# Altium schematic sheet BDAN.SchDoc
size A4; SheetNumber: 1; SheetTotal: 5
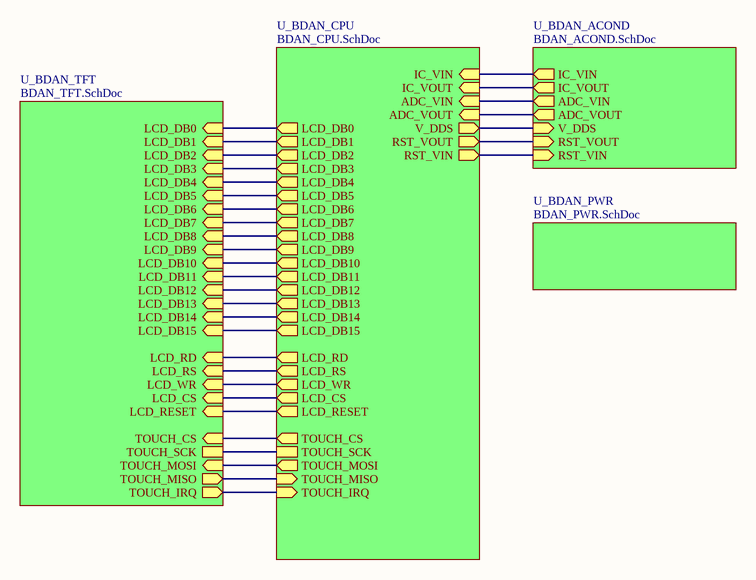
[diagram p0: BDAN.SchDoc]

## Sub-sheets
U_BDAN_ACOND = BDAN_ACOND.SchDoc: IC_VIN (out), IC_VOUT (out), ADC_VIN (out), ADC_VOUT (out), V_DDS (in), RST_VOUT (in), RST_VIN (in)
U_BDAN_CPU = BDAN_CPU.SchDoc: V_DDS (out), LCD_WR (out), LCD_RD (out), LCD_DB8 (out), LCD_DB9 (out), LCD_DB10 (out), LCD_DB11 (out), LCD_DB12 (out), LCD_DB13 (out), LCD_DB14 (out), LCD_DB15 (out), LCD_DB2 (out), LCD_DB3 (out), LCD_DB4 (out), LCD_DB5 (out), LCD_DB6 (out), LCD_DB7 (out), TOUCH_SCK, TOUCH_CS (out), TOUCH_MOSI (out), TOUCH_MISO (in), LCD_DB1 (out), LCD_DB0 (out), LCD_RS (out), LCD_RESET (out), ADC_VIN (in), ADC_VOUT (in), TOUCH_IRQ (in), RST_VOUT (out), IC_VIN (in), LCD_CS (out), IC_VOUT (in), RST_VIN (out)
U_BDAN_PWR = BDAN_PWR.SchDoc: no entries
U_BDAN_TFT = BDAN_TFT.SchDoc: LCD_RS (in), LCD_WR (in), LCD_RD (in), LCD_DB8 (in), LCD_DB9 (in), LCD_DB10 (in), LCD_DB11 (in), LCD_DB12 (in), LCD_DB13 (in), LCD_DB14 (in), LCD_DB15 (in), LCD_CS (in), LCD_RESET (in), LCD_DB2 (in), LCD_DB3 (in), LCD_DB4 (in), LCD_DB5 (in), LCD_DB6 (in), LCD_DB7 (in), TOUCH_SCK, TOUCH_CS (in), TOUCH_MOSI (in), TOUCH_MISO (out), TOUCH_IRQ (out), LCD_DB1 (in), LCD_DB0 (in)

## Nets
(unnamed): sheet U_BDAN_ACOND/IC_VIN, sheet U_BDAN_CPU/IC_VIN
(unnamed): sheet U_BDAN_ACOND/IC_VOUT, sheet U_BDAN_CPU/IC_VOUT
(unnamed): sheet U_BDAN_ACOND/ADC_VIN, sheet U_BDAN_CPU/ADC_VIN
(unnamed): sheet U_BDAN_ACOND/ADC_VOUT, sheet U_BDAN_CPU/ADC_VOUT
(unnamed): sheet U_BDAN_ACOND/V_DDS, sheet U_BDAN_CPU/V_DDS
(unnamed): sheet U_BDAN_ACOND/RST_VOUT, sheet U_BDAN_CPU/RST_VOUT
(unnamed): sheet U_BDAN_ACOND/RST_VIN, sheet U_BDAN_CPU/RST_VIN
(unnamed): sheet U_BDAN_CPU/LCD_WR, sheet U_BDAN_TFT/LCD_WR
(unnamed): sheet U_BDAN_CPU/LCD_RD, sheet U_BDAN_TFT/LCD_RD
(unnamed): sheet U_BDAN_CPU/LCD_DB8, sheet U_BDAN_TFT/LCD_DB8
(unnamed): sheet U_BDAN_CPU/LCD_DB9, sheet U_BDAN_TFT/LCD_DB9
(unnamed): sheet U_BDAN_CPU/LCD_DB10, sheet U_BDAN_TFT/LCD_DB10
(unnamed): sheet U_BDAN_CPU/LCD_DB11, sheet U_BDAN_TFT/LCD_DB11
(unnamed): sheet U_BDAN_CPU/LCD_DB12, sheet U_BDAN_TFT/LCD_DB12
(unnamed): sheet U_BDAN_CPU/LCD_DB13, sheet U_BDAN_TFT/LCD_DB13
(unnamed): sheet U_BDAN_CPU/LCD_DB14, sheet U_BDAN_TFT/LCD_DB14
(unnamed): sheet U_BDAN_CPU/LCD_DB15, sheet U_BDAN_TFT/LCD_DB15
(unnamed): sheet U_BDAN_CPU/LCD_DB2, sheet U_BDAN_TFT/LCD_DB2
(unnamed): sheet U_BDAN_CPU/LCD_DB3, sheet U_BDAN_TFT/LCD_DB3
(unnamed): sheet U_BDAN_CPU/LCD_DB4, sheet U_BDAN_TFT/LCD_DB4
(unnamed): sheet U_BDAN_CPU/LCD_DB5, sheet U_BDAN_TFT/LCD_DB5
(unnamed): sheet U_BDAN_CPU/LCD_DB6, sheet U_BDAN_TFT/LCD_DB6
(unnamed): sheet U_BDAN_CPU/LCD_DB7, sheet U_BDAN_TFT/LCD_DB7
(unnamed): sheet U_BDAN_CPU/TOUCH_SCK, sheet U_BDAN_TFT/TOUCH_SCK
(unnamed): sheet U_BDAN_CPU/TOUCH_CS, sheet U_BDAN_TFT/TOUCH_CS
(unnamed): sheet U_BDAN_CPU/TOUCH_MOSI, sheet U_BDAN_TFT/TOUCH_MOSI
(unnamed): sheet U_BDAN_CPU/TOUCH_MISO, sheet U_BDAN_TFT/TOUCH_MISO
(unnamed): sheet U_BDAN_CPU/LCD_DB1, sheet U_BDAN_TFT/LCD_DB1
(unnamed): sheet U_BDAN_CPU/LCD_DB0, sheet U_BDAN_TFT/LCD_DB0
(unnamed): sheet U_BDAN_CPU/LCD_RS, sheet U_BDAN_TFT/LCD_RS
(unnamed): sheet U_BDAN_CPU/LCD_RESET, sheet U_BDAN_TFT/LCD_RESET
(unnamed): sheet U_BDAN_CPU/TOUCH_IRQ, sheet U_BDAN_TFT/TOUCH_IRQ
(unnamed): sheet U_BDAN_CPU/LCD_CS, sheet U_BDAN_TFT/LCD_CS